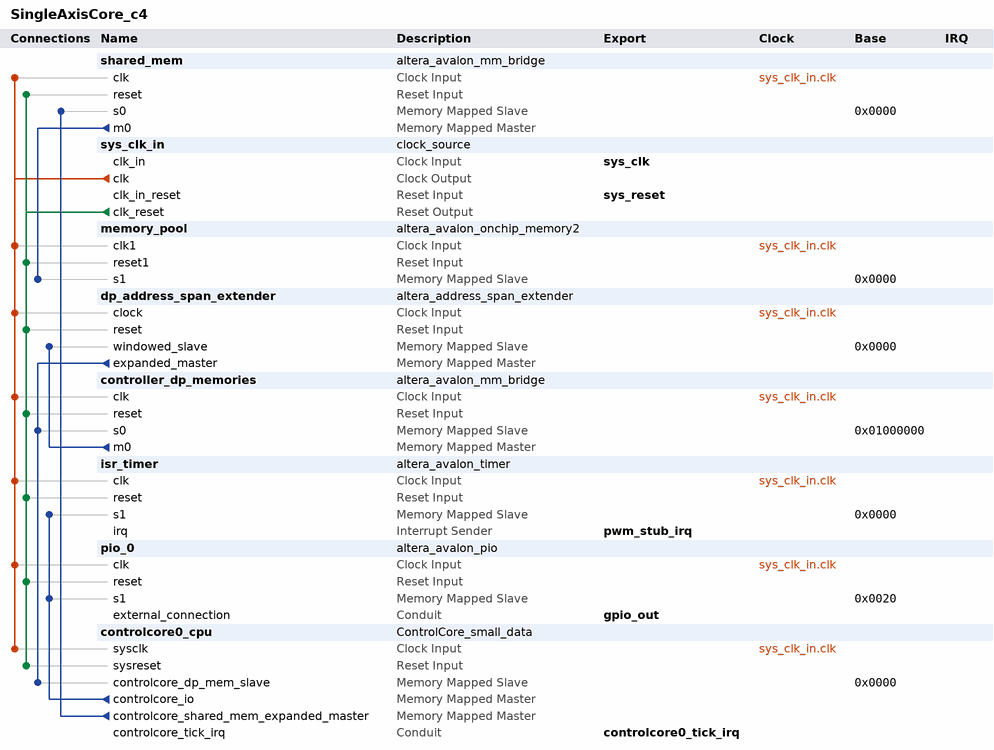
[diagram p0: system contents]
# Platform Designer (Qsys) system SingleAxisCore_c4, Cyclone IV E EP4CE22F17C6
# Parameters at their usual value, and those the tool derives, are not listed.
package require -exact qsys 18.1
create_system SingleAxisCore_c4
set_project_property DEVICE_FAMILY {Cyclone IV E}
set_project_property DEVICE EP4CE22F17C6

add_instance shared_mem altera_avalon_mm_bridge 18.1
set_instance_parameter_value shared_mem ADDRESS_UNITS SYMBOLS
set_instance_parameter_value shared_mem ADDRESS_WIDTH 24
set_instance_parameter_value shared_mem DATA_WIDTH 32
set_instance_parameter_value shared_mem MAX_BURST_SIZE 2
set_instance_parameter_value shared_mem MAX_PENDING_RESPONSES 4
set_instance_parameter_value shared_mem USE_AUTO_ADDRESS_WIDTH 0

add_instance sys_clk_in clock_source 18.1
set_instance_parameter_value sys_clk_in clockFrequency 200000000

add_instance memory_pool altera_avalon_onchip_memory2 18.1
set_instance_parameter_value memory_pool dataWidth 32
set_instance_parameter_value memory_pool dualPort false
set_instance_parameter_value memory_pool initMemContent false
set_instance_parameter_value memory_pool initializationFileName onchip_mem.hex
set_instance_parameter_value memory_pool memorySize 32768

add_instance dp_address_span_extender altera_address_span_extender 18.1
set_instance_parameter_value dp_address_span_extender BURSTCOUNT_WIDTH 2
set_instance_parameter_value dp_address_span_extender DATA_WIDTH 32
set_instance_parameter_value dp_address_span_extender ENABLE_SLAVE_PORT false
set_instance_parameter_value dp_address_span_extender MASTER_ADDRESS_DEF 0
set_instance_parameter_value dp_address_span_extender MAX_PENDING_READS 4
set_instance_parameter_value dp_address_span_extender SLAVE_ADDRESS_WIDTH 16

add_instance controller_dp_memories altera_avalon_mm_bridge 18.1
set_instance_parameter_value controller_dp_memories ADDRESS_UNITS SYMBOLS
set_instance_parameter_value controller_dp_memories ADDRESS_WIDTH 18
set_instance_parameter_value controller_dp_memories DATA_WIDTH 32
set_instance_parameter_value controller_dp_memories MAX_BURST_SIZE 2
set_instance_parameter_value controller_dp_memories MAX_PENDING_RESPONSES 4
set_instance_parameter_value controller_dp_memories USE_AUTO_ADDRESS_WIDTH 0

add_instance isr_timer altera_avalon_timer 18.1
set_instance_parameter_value isr_timer fixedPeriod true
set_instance_parameter_value isr_timer period 50
set_instance_parameter_value isr_timer periodUnits USEC
set_instance_parameter_value isr_timer snapshot false

add_instance pio_0 altera_avalon_pio 18.1
set_instance_parameter_value pio_0 direction Output
set_instance_parameter_value pio_0 width 8

add_instance controlcore0_cpu ControlCore_small_data 1.0

# connections
add_connection sys_clk_in.clk controlcore0_cpu.sysclk clock
add_connection sys_clk_in.clk controller_dp_memories.clk clock
add_connection sys_clk_in.clk dp_address_span_extender.clock clock
add_connection sys_clk_in.clk isr_timer.clk clock
add_connection sys_clk_in.clk memory_pool.clk1 clock
add_connection sys_clk_in.clk pio_0.clk clock
add_connection sys_clk_in.clk shared_mem.clk clock
add_connection sys_clk_in.clk_reset controlcore0_cpu.sysreset reset
add_connection sys_clk_in.clk_reset controller_dp_memories.reset reset
add_connection sys_clk_in.clk_reset dp_address_span_extender.reset reset
add_connection sys_clk_in.clk_reset isr_timer.reset reset
add_connection sys_clk_in.clk_reset memory_pool.reset1 reset
add_connection sys_clk_in.clk_reset pio_0.reset reset
add_connection sys_clk_in.clk_reset shared_mem.reset reset
add_connection controlcore0_cpu.controlcore_io isr_timer.s1 avalon
set_connection_parameter_value controlcore0_cpu.controlcore_io/isr_timer.s1 baseAddress 0x0000
add_connection controlcore0_cpu.controlcore_io pio_0.s1 avalon
set_connection_parameter_value controlcore0_cpu.controlcore_io/pio_0.s1 baseAddress 0x0020
add_connection controlcore0_cpu.controlcore_shared_mem_expanded_master shared_mem.s0 avalon
set_connection_parameter_value controlcore0_cpu.controlcore_shared_mem_expanded_master/shared_mem.s0 baseAddress 0x0000
add_connection controller_dp_memories.m0 dp_address_span_extender.windowed_slave avalon
set_connection_parameter_value controller_dp_memories.m0/dp_address_span_extender.windowed_slave baseAddress 0x0000
add_connection dp_address_span_extender.expanded_master controlcore0_cpu.controlcore_dp_mem_slave avalon
set_connection_parameter_value dp_address_span_extender.expanded_master/controlcore0_cpu.controlcore_dp_mem_slave baseAddress 0x0000
add_connection dp_address_span_extender.expanded_master controller_dp_memories.s0 avalon
set_connection_parameter_value dp_address_span_extender.expanded_master/controller_dp_memories.s0 baseAddress 0x01000000
add_connection shared_mem.m0 memory_pool.s1 avalon
set_connection_parameter_value shared_mem.m0/memory_pool.s1 baseAddress 0x0000

# exported interfaces
add_interface controlcore0_tick_irq conduit end
set_interface_property controlcore0_tick_irq EXPORT_OF controlcore0_cpu.controlcore_tick_irq
add_interface gpio_out conduit end
set_interface_property gpio_out EXPORT_OF pio_0.external_connection
add_interface pwm_stub_irq interrupt sender
set_interface_property pwm_stub_irq EXPORT_OF isr_timer.irq
add_interface sys_clk clock sink
set_interface_property sys_clk EXPORT_OF sys_clk_in.clk_in
add_interface sys_reset reset sink
set_interface_property sys_reset EXPORT_OF sys_clk_in.clk_in_reset

set_interconnect_requirement {$system} qsys_mm.clockCrossingAdapter HANDSHAKE
set_interconnect_requirement {$system} qsys_mm.enableEccProtection FALSE
set_interconnect_requirement {$system} qsys_mm.insertDefaultSlave FALSE
set_interconnect_requirement {$system} qsys_mm.maxAdditionalLatency 1

save_system SingleAxisCore_c4.qsys
